# Altium schematic sheet Motors.SchDoc
size A4
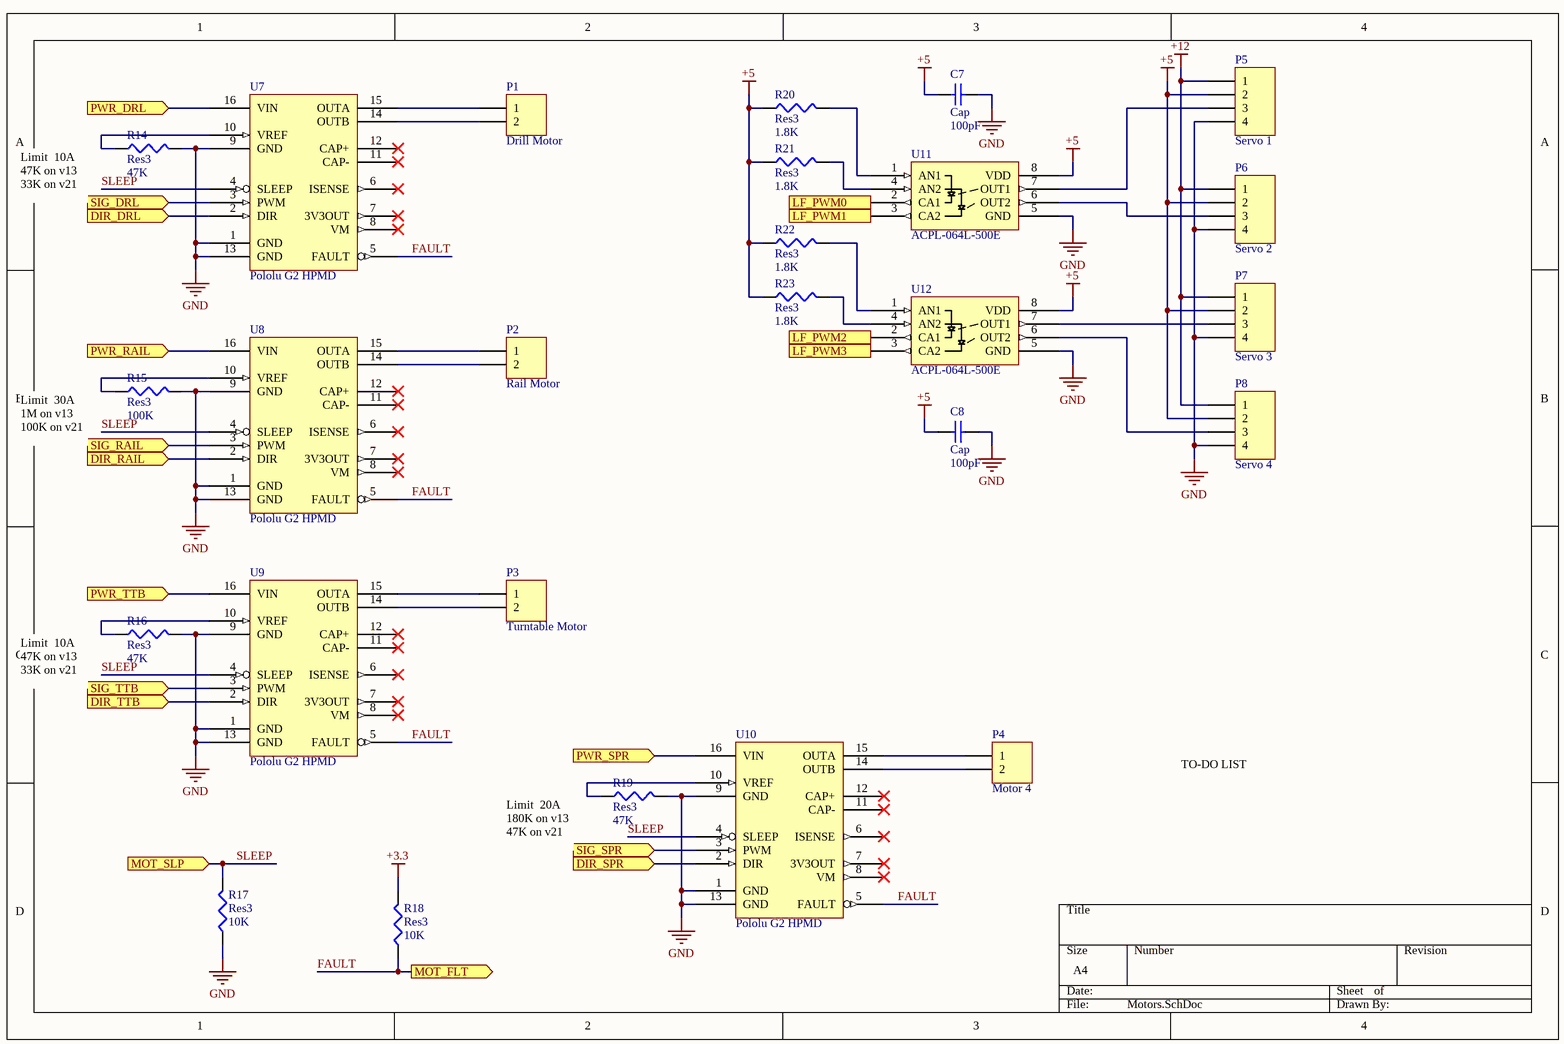
[diagram p0: Motors.SchDoc]

## Parts
C7  Cap  value 100pF  [C0805]
C8  Cap  value 100pF  [C0805]
P1  Drill Motor  [Sabre-2pos]
P2  Rail Motor  [Sabre-2pos]
P3  Turntable Motor  [Sabre-2pos]
P4  Motor 4  [Sabre-2pos]
P5  Servo 1  [22-23-20x1-4pos]
P6  Servo 2  [22-23-20x1-4pos]
P7  Servo 3  [22-23-20x1-4pos]
P8  Servo 4  [22-23-20x1-4pos]
R14  Res3  value 47K  [C0805]
R15  Res3  value 100K  [C0805]
R16  Res3  value 47K  [C0805]
R17  Res3  value 10K  [C0805]
R18  Res3  value 10K  [C0805]
R19  Res3  value 47K  [C0805]
R20  Res3  value 1.8K  [C0805]
R21  Res3  value 1.8K  [C0805]
R22  Res3  value 1.8K  [C0805]
R23  Res3  value 1.8K  [C0805]
U7  Pololu G2 HPMD  [Pololu-HPMDG2-SCIENCE]
U8  Pololu G2 HPMD  [Pololu-HPMDG2-SCIENCE]
U9  Pololu G2 HPMD  [Pololu-HPMDG2-SCIENCE]
U10  Pololu G2 HPMD  [Pololu-HPMDG2-SCIENCE]
U11  ACPL-064L-500E  [ACPL-064L]
U12  ACPL-064L-500E  [ACPL-064L]

## Ports
DIR_DRL (in), DIR_RAIL (in), DIR_SPR (in), DIR_TTB (in), LF_PWM0 (out), LF_PWM1 (out), LF_PWM2 (out), LF_PWM3 (out), MOT_FLT (out), MOT_SLP (in), PWR_DRL (in), PWR_RAIL (in), PWR_SPR (in), PWR_TTB (in), SIG_DRL (in), SIG_RAIL (in), SIG_SPR (in), SIG_TTB (in)

## Nets
+3.3: R18.2
+5: C7.2 C8.2 P5.2 P6.2 P7.2 P8.2 R20.1 R21.1 R22.1 R23.1 U11.8(VDD) U12.8(VDD)
+12: P5.1 P6.1 P7.1 P8.1
GND: C7.1 C8.1 P5.4 P6.4 P7.4 P8.4 R14.2 R15.2 R16.2 R17.1 R19.2 U7.1(GND) U7.9(GND) U7.13(GND) U8.1(GND) U8.9(GND) U8.13(GND) U9.1(GND) U9.9(GND) U9.13(GND) U10.1(GND) U10.9(GND) U10.13(GND) U11.5(GND) U12.5(GND)
DIR_DRL: U7.2(DIR) ; port DIR_DRL
DIR_RAIL: U8.2(DIR) ; port DIR_RAIL
DIR_SPR: U10.2(DIR) ; port DIR_SPR
DIR_TTB: U9.2(DIR) ; port DIR_TTB
FAULT: R18.1 U7.5(FAULT) U8.5(FAULT) U9.5(FAULT) U10.5(FAULT) ; port MOT_FLT
LF_PWM0: U11.2(CA1) ; port LF_PWM0
LF_PWM1: U11.3(CA2) ; port LF_PWM1
LF_PWM2: U12.2(CA1) ; port LF_PWM2
LF_PWM3: U12.3(CA2) ; port LF_PWM3
PWR_DRL: U7.16(VIN) ; port PWR_DRL
PWR_RAIL: U8.16(VIN) ; port PWR_RAIL
PWR_SPR: U10.16(VIN) ; port PWR_SPR
PWR_TTB: U9.16(VIN) ; port PWR_TTB
SIG_DRL: U7.3(PWM) ; port SIG_DRL
SIG_RAIL: U8.3(PWM) ; port SIG_RAIL
SIG_SPR: U10.3(PWM) ; port SIG_SPR
SIG_TTB: U9.3(PWM) ; port SIG_TTB
SLEEP: R17.2 U7.4(SLEEP) U8.4(SLEEP) U9.4(SLEEP) U10.4(SLEEP) ; port MOT_SLP
NetP1_1: P1.1 U7.15(OUTA)
NetP1_2: P1.2 U7.14(OUTB)
NetP2_1: P2.1 U8.15(OUTA)
NetP2_2: P2.2 U8.14(OUTB)
NetP3_1: P3.1 U9.15(OUTA)
NetP3_2: P3.2 U9.14(OUTB)
NetP4_1: P4.1 U10.15(OUTA)
NetP4_2: P4.2 U10.14(OUTB)
NetP5_3: P5.3 U11.7(OUT1)
NetP6_3: P6.3 U11.6(OUT2)
NetP7_3: P7.3 U12.7(OUT1)
NetP8_3: P8.3 U12.6(OUT2)
NetR14_1: R14.1 U7.10(VREF)
NetR15_1: R15.1 U8.10(VREF)
NetR16_1: R16.1 U9.10(VREF)
NetR19_1: R19.1 U10.10(VREF)
NetR20_2: R20.2 U11.1(AN1)
NetR21_2: R21.2 U11.4(AN2)
NetR22_2: R22.2 U12.1(AN1)
NetR23_2: R23.2 U12.4(AN2)

Not connected (* = marked no-connect by the designer): U7 6(ISENSE)* 7(3V3OUT)* 8(VM)* 11(CAP-)* 12(CAP+)*; U8 6(ISENSE)* 7(3V3OUT)* 8(VM)* 11(CAP-)* 12(CAP+)*; U9 6(ISENSE)* 7(3V3OUT)* 8(VM)* 11(CAP-)* 12(CAP+)*; U10 6(ISENSE)* 7(3V3OUT)* 8(VM)* 11(CAP-)* 12(CAP+)*

## Notes on the sheet
- (near R14) Limit  10A
  47K on v13
  33K on v21
- (near R15) Limit  30A
  1M on v13
  100K on v21
- (near R16) Limit  10A
  47K on v13
  33K on v21
- (near R19) Limit  20A
  180K on v13
  47K on v21
- TO-DO LIST

## Library data of the parts
C7 C8 = Cap: Capacitor; Published: 8-Jun-2000; LatestRevisionDate: 17-Jul-2002; LatestRevisionNote: Re-released for DXP Platform.; PackageReference: RAD-0.3; Publisher: Altium Limited; PackageDescription: Radial Cap, Thru-Hole; 2 Leads; 0.3 in Pin Spacing
P1-P4 = Header 2: Header, 2-Pin; LatestRevisionDate: 17-Jul-2002; LatestRevisionNote: Re-released for DXP Platform.; Publisher: Altium Limited
P5-P8 = Header 4: Header, 4-Pin; LatestRevisionDate: 17-Jul-2002; LatestRevisionNote: Re-released for DXP Platform.; Publisher: Altium Limited
R14-R23 = Res3: Resistor; Published: 8-Jun-2000; LatestRevisionDate: 29-May-2009; LatestRevisionNote: IPC-7351 Footprint Added.; PackageReference: J1-0603; Publisher: Altium Limited; PackageDescription: Chip Resistor
U7-U10 = Pololu-G2HPMD: Discrete MOSFET H-bridge; ComponentLink1Description: Website; ComponentLink1URL: https://www.pololu.com/product/2995
U11 U12 = ACPL-064L-500E: Low-Power 10-MBd Digital CMOS Optocouplers